# EAGLE design half-pint-turbidimeter_tsl230rd_2.0.1 (EAGLE 7.2.0)
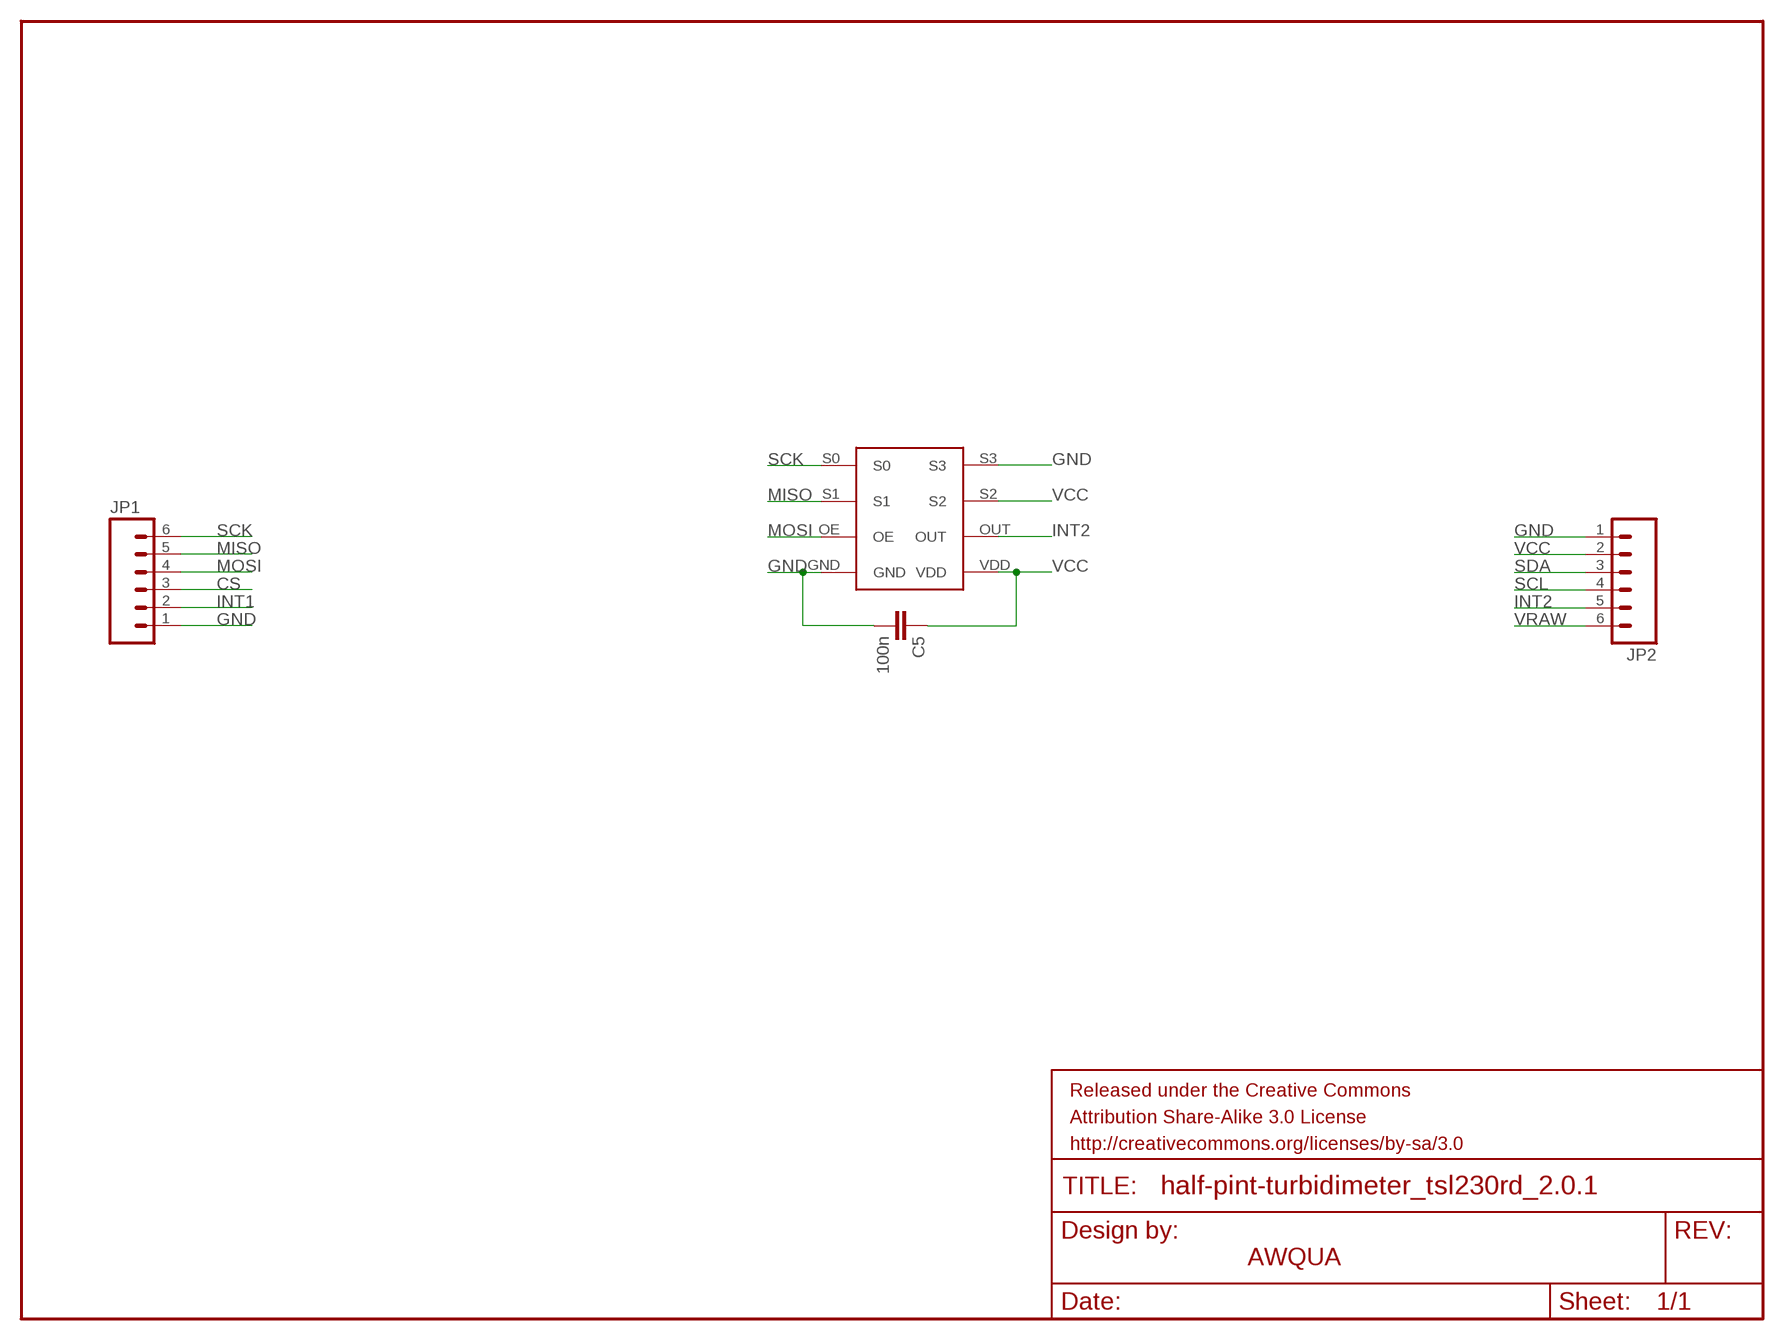
[diagram p0: schematic, sheet 1]

## Parts
C5  100n  CAP0603-CAP  [0603-CAP]
FRAME1  FRAME-LETTER  [CREATIVE_COMMONS]
JP1  M06SIP  [1X06]
JP2  M06SIP  [1X06]
U$6  TSL230RDSMD  [TSL230RD]

## Nets
CS: JP1.3
GND: C5.2 JP1.1 JP2.1 U$6.GND U$6.S3
INT1: JP1.2
INT2: JP2.5 U$6.OUT
MISO: JP1.5 U$6.S1
MOSI: JP1.4 U$6.OE
SCK: JP1.6 U$6.S0
SCL: JP2.4
SDA: JP2.3
VCC: C5.1 JP2.2 U$6.S2 U$6.VDD
VRAW: JP2.6

## Notes on the sheet
- AWQUA

## Library data of the parts
C5 = SparkFun:CAP: Capacitor Standard 0603 ceramic capacitor, and 0.1" leaded capacitor.
FRAME1 = SparkFun-Aesthetics:FRAME-LETTER: Schematic Frame Standard 8.5x11 US Letter frame
JP1 JP2 = SparkFun-Connectors:M06: Header 6 Standard 6-pin 0.1" header. Use with straight break away headers (SKU : PRT-00116), right angle break away headers (PRT-00553), swiss pins (PRT-00743), machine pins (PRT-00117), and female headers (PRT-00115). Molex polarized connector foot print use with SKU : PRT-08094 with associated crimp pins and housings. NOTES ON THE VARIANTS LOCK and LOCK_LONGPADS... This footprint was designed to help hold the alignment of a through-hole component (i.e. 6-pin header) while soldering it into place. You may notice that each hole has been shifted either up or down by 0.005 of an inch from it's more standard position (which is a perfectly straight line). This slight alteration caused the pins (the squares in the middle) to touch the edges of the holes. Because they are alternating, it causes a "brace" to hold the component in place. 0.005 has proven to be the perfect amount of "off-center" position when using our standard breakaway headers. Although looks a little odd when you look at the bare footprint, once you have a header in there, the alteration is very hard to notice. Also,if you push a header all the way into place, it is covered up entirely on the bottom side. This idea of altering the position of holes to aid alignment will be further integrated into the Sparkfun Library for other footprints. It can help hold any component with 3 or more connection pins.
U$6 = awqua_eagle_library:TSL230RD

## Board
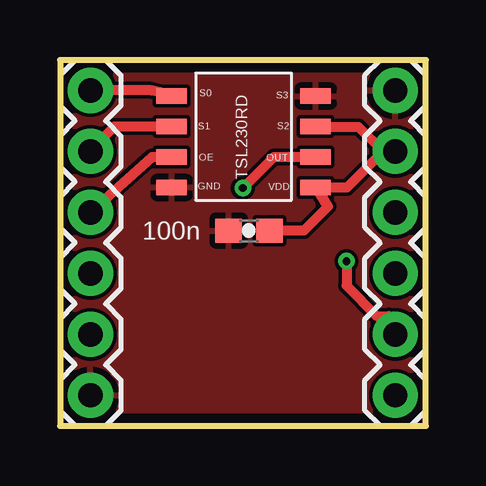
[diagram p1: board, top side]
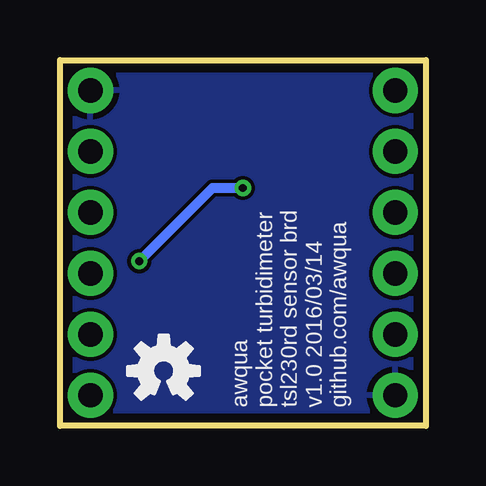
[diagram p2: board, bottom side, seen from below]

Size 15.24 x 15.24 mm. Coordinates in mm from the lower left corner, seen from the top.
Outline: 0,0 15.24,0 15.24,15.24 0,15.24 0,0
Copper layers (1*16): Top 0.0356mm / dielectric 1.5011mm / Bottom 0.0356mm
Design rules "default *": minimum track width 6mil, minimum drill 13mil, track to track 6mil, track to pad 6mil, pad to pad 6mil, via to via 6mil, smd to smd 6mil, copper to edge 15mil, drill to drill 6mil, minimum pad ring 7mil, minimum via ring 7mil, stop-mask expansion 4mil, vias tented up to drill 15mil, thermal gap 10mil

### Footprints (pad centres in the part's own frame; a part is rotated, then mirrored left to right if it is on the bottom)
0603-CAP = smd 1.1 x 1: 1 -0.85,0; 2 0.85,0
1X06 = drill 1.016 pad 1.88: 1 0,0; 2 2.54,0; 3 5.08,0; 4 7.62,0; 5 10.16,0; 6 12.7,0
TSL230RD = smd 0.635 x 1.27: GND 0.53,5; OE 1.8,5; OUT 1.8,-1; S0 4.34,5; S1 3.07,5; S2 3.07,-1; S3 4.34,-1; VDD 0.53,-1

### Placement (x,y rotation side)
C5  7.87,8.13 180 top
FRAME1  20.95,-7.62 0 top  (outside the outline)
JP1  1.27,1.27 90 top
JP2  13.97,13.97 270 top
U$5  [OSHW-LOGO-S]  10.92,2.29 0 bottom
U$6  9.65,9.4 90 top

### Tracks (layer width: path | path; a pad name or v marks a point on that pad's centre or on a via)
GND
  pour Top: -3.56,42.93 50.29,43.18 50.8,-0.76 -3.05,-1.02
  pour Bottom: -2.54,43.43 50.04,44.2 50.29,-0.76 -2.54,-0.25
INT2  (via drill 0.33)
  Top 0.406: U$6.OUT 8.91,11.2 v7.62,9.91 | v11.94,6.86 11.94,5.84 13.21,4.57 13.72,4.57 JP2.5
  Bottom 0.406: v7.62,9.91 8.89,9.91 10.41,8.38 v11.94,6.86
MISO
  Top 0.406: U$6.S1 2.26,12.47 JP1.5
MOSI
  Top 0.406: U$6.OE 3.83,11.2 JP1.4
SCK
  Top 0.406: U$6.S0 4.14,13.89 3.81,13.97 JP1.6
VCC
  Top 0.406: JP2.2 13.46,11.43 | 13.46,11.43 12.45,12.45 11.18,12.45 U$6.S2 | 13.46,11.43 11.96,9.93 U$6.VDD 11.16,9.13 10.16,8.13 C5.1

### Text on the board
bNames: awqua / pocket turbidimeter / tsl230rd sensor brd / v1.0 2016/03/14 / github.com/awqua